# EAGLE design Design_final (EAGLE 9.2.2)
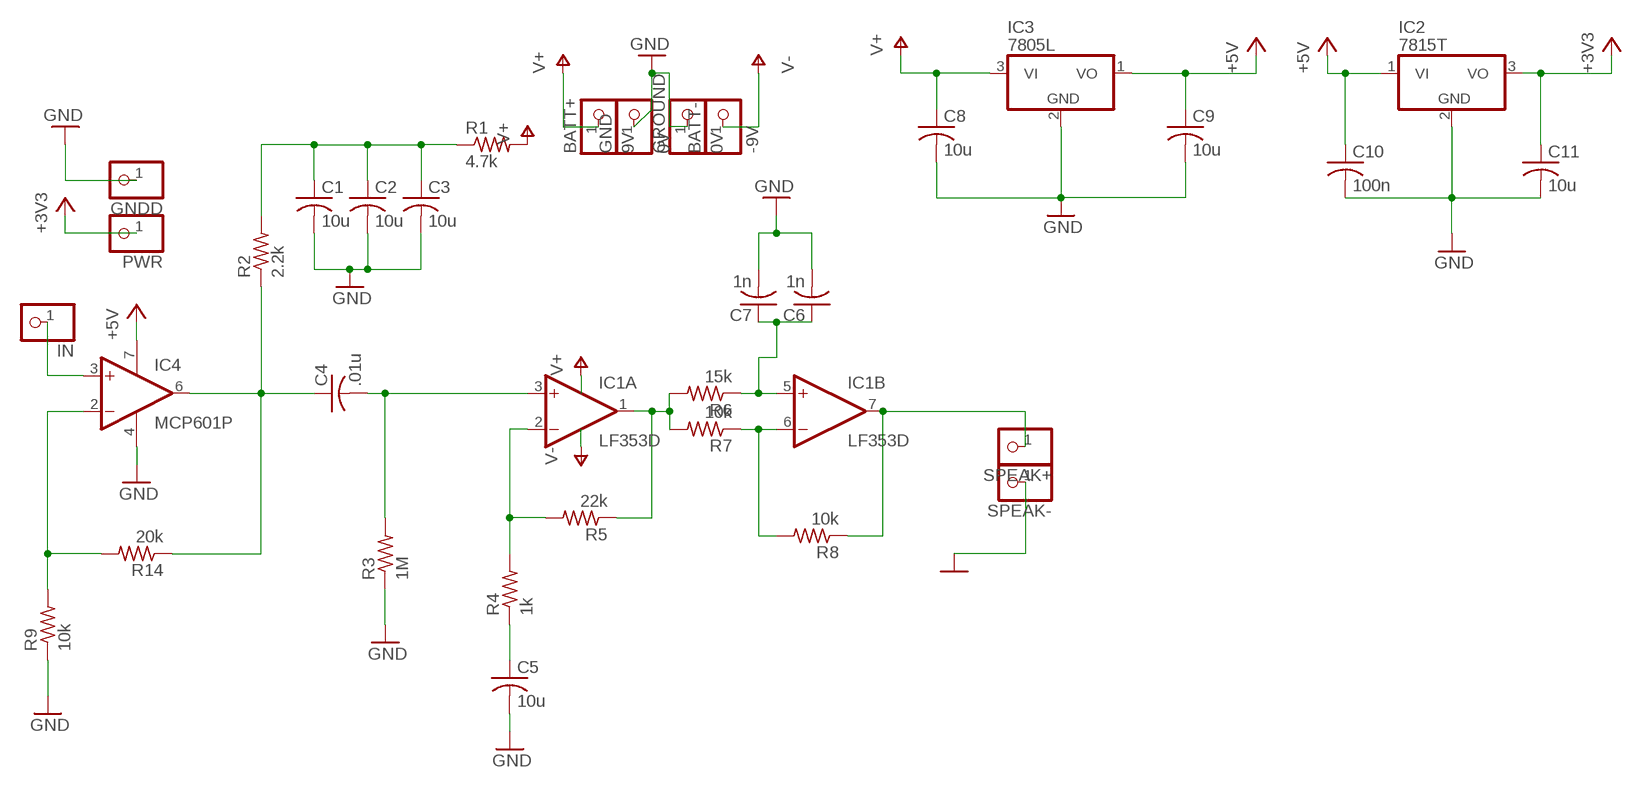
[diagram p0: schematic, sheet 1]

## Parts
BATT+  9V  PINHD-1X1  [1X01]
BATT-  -9V  PINHD-1X1  [1X01]
C1  10u  C-USC0805  [C0805]
C2  10u  C-USC0805  [C0805]
C3  10u  C-USC0805  [C0805]
C4  .01u  C-USC0805  [C0805]
C5  10u  C-USC0805  [C0805]
C6  1n  C-USC0805  [C0805]
C7  1n  C-USC0805  [C0805]
C8  10u  C-USC0805  [C0805]
C9  10u  C-USC0805  [C0805]
C10  100n  C-USC0805  [C0805]
C11  10u  C-USC0805  [C0805]
GND  0V  PINHD-1X1  [1X01]
GNDD  PINHD-1X1  [1X01]
GROUND  0V  PINHD-1X1  [1X01]
IC1  LF353D  [SO08]
IC2  7815T  [TO220H]
IC3  7805L  [TO92]
IC4  MCP601P  [DIL08]
IN  PINHD-1X1  [1X01]
PWR  PINHD-1X1  [1X01]
R1  4.7k  R-US_M0805  [M0805]
R2  2.2k  R-US_M0805  [M0805]
R3  1M  R-US_M0805  [M0805]
R4  1k  R-US_M0805  [M0805]
R5  22k  R-US_M0805  [M0805]
R6  15k  R-US_M0805  [M0805]
R7  10k  R-US_M0805  [M0805]
R8  10k  R-US_M0805  [M0805]
R9  10k  R-US_M0805  [M0805]
R14  20k  R-US_M0805  [M0805]
SPEAK+  PINHD-1X1  [1X01]
SPEAK-  PINHD-1X1  [1X01]

## Nets
+3V3: C11.1 IC2.3(VO) PWR.1
+5V: C9.1 C10.1 IC2.1(VI) IC3.1(VO) IC4.7(V+)
GND: C1.2 C2.2 C3.2 C5.2 C6.2 C7.2 C8.2 C9.2 C10.2 C11.2 GND.1 GNDD.1 GROUND.1 IC2.2(GND) IC3.2(GND) IC4.4(V-) R3.1 R9.1 SPEAK-.1
N$1: C1.1 C2.1 C3.1 R1.1 R2.2
N$2: IC1.6(B:-IN) R7.1 R8.2
N$3: IC4.3(+IN) IN.1
N$4: C4.1 IC4.6(OUT) R2.1 R14.1
N$6: C4.2 IC1.3(A:+IN) R3.2
N$7: IC1.2(A:-IN) R4.2 R5.2
N$8: C5.1 R4.1
N$9: IC1.1(A:OUT) R5.1 R6.2 R7.2
N$12: IC1.7(B:OUT) R8.1 SPEAK+.1
N$13: C6.1 C7.1 IC1.5(B:+IN) R6.1
N$15: IC4.2(-IN) R9.2 R14.2
V+: BATT+.1 C8.1 IC3.3(VI) R1.2
V-: BATT-.1

## Power pins joined to a net without a drawn wire
V+: IC1.8(P:V+)
V-: IC1.4(P:V-)

## Library data of the parts
BATT+ BATT- GND GNDD GROUND IN PWR SPEAK+ SPEAK- = adafruit:PINHD-1X1: Pin header 1x1 for 0.1" spacing With round pins
C1-C11 = adafruit:C-US: CAPACITOR, American symbol
IC1 = linear:LF353: OP AMP
IC2 IC3 = adafruit:78*: Positive VOLTAGE REGULATOR Added bigger pads to the TO-92 package
IC4 = linear:MCP601: Single Op Amp 2.7V to 6.0V Single Supply CMOS Source: http://ww1.microchip.com/downloads/en/DeviceDoc/21314g.pdf
R1-R9 R14 = adafruit:R-US_: RESISTOR, American symbol

## Net classes
0 default: width 0.508 mm, clearance 0.508 mm

## Board
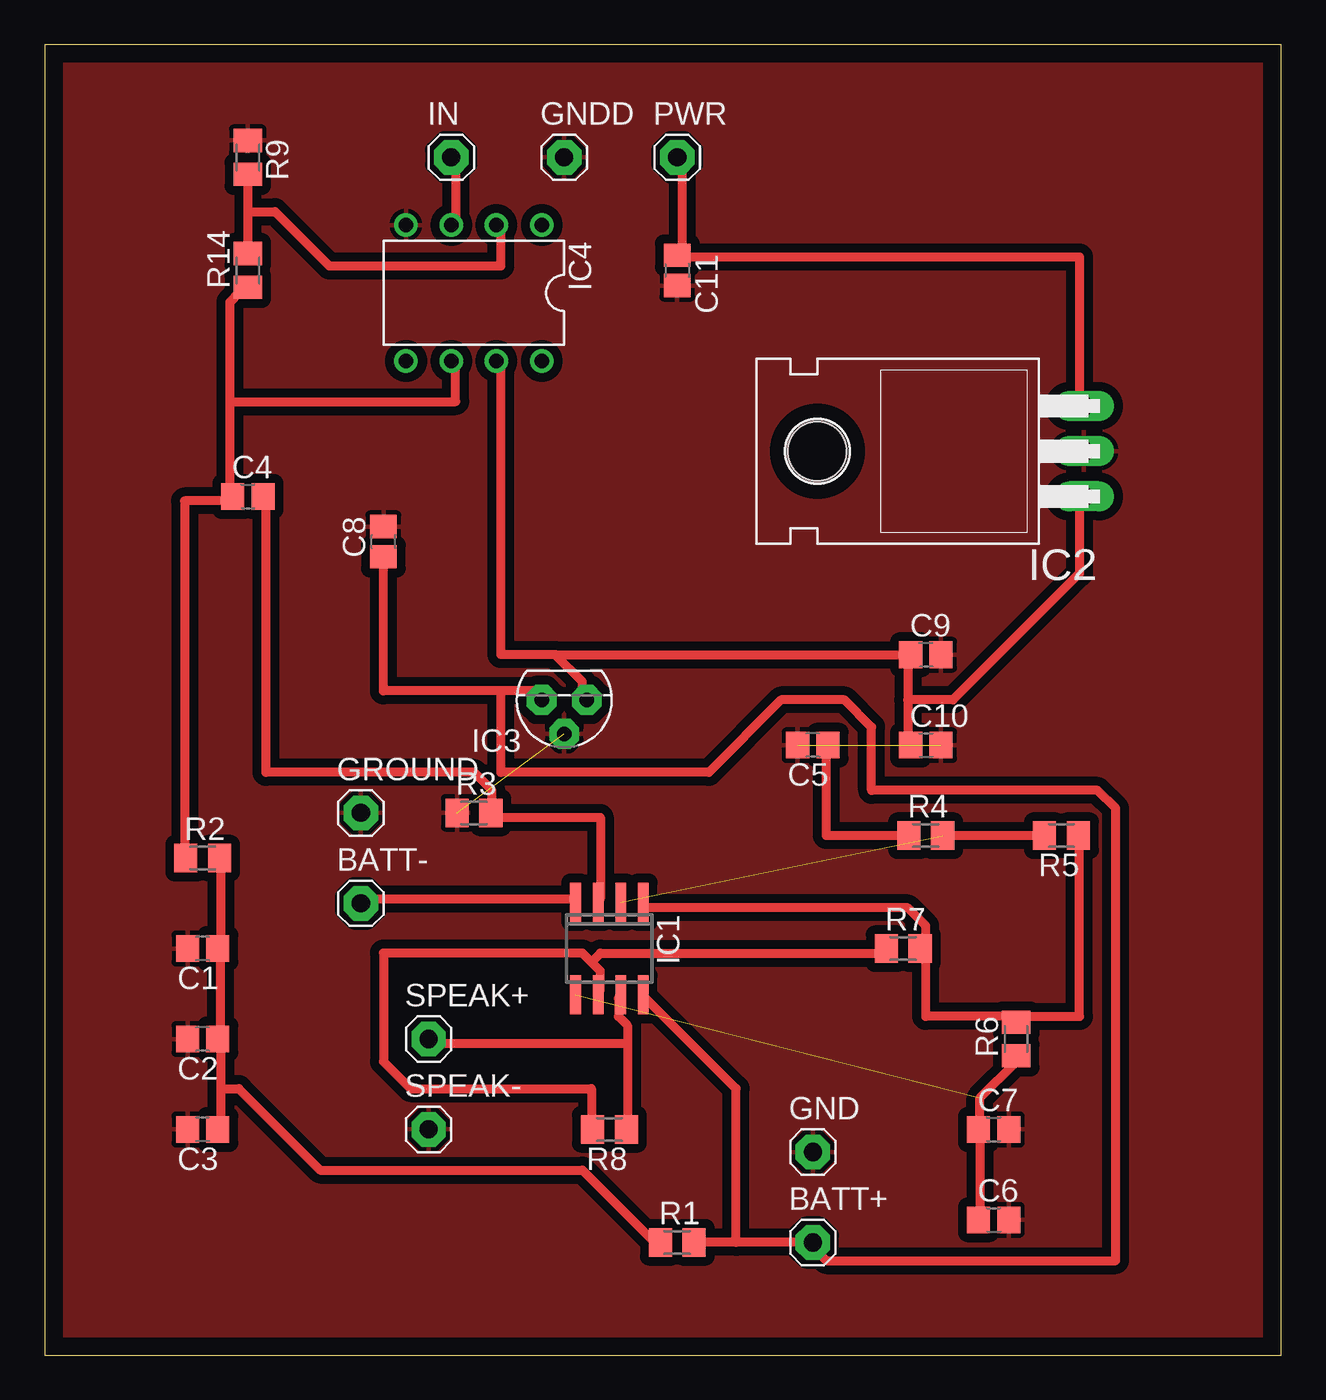
[diagram p1: board, top side]

Size 69.52 x 73.65 mm. Coordinates in mm from the lower left corner, seen from the top.
Outline: 0,0 69.52,0 69.52,73.65 0,73.65 0,0
Copper layers (1*16): Top 0.035mm / dielectric 1.5mm / Bottom 0.035mm
Design rules "default *": minimum track width 20mil, minimum drill 0.35mm, track to track 20mil, track to pad 20mil, pad to pad 20mil, via to via 20mil, smd to smd 20mil, copper to edge 40mil, drill to drill 6mil, minimum pad ring 10mil, minimum via ring 8mil, stop-mask expansion 4mil, vias tented up to drill 0mil, thermal gap 10mil

### Footprints (pad centres in the part's own frame; a part is rotated, then mirrored left to right if it is on the bottom)
1X01 = drill 1.016 pad 1.93 octagon: 1 0,0
C0805 = smd 1.3 x 1.5: 1 -0.85,0; 2 0.85,0
SO08 = smd 0.6 x 2.2: 1 -1.905,-2.6; 2 -0.635,-2.6; 3 0.635,-2.6; 4 1.905,-2.6; 5 1.905,2.6; 6 0.635,2.6; 7 -0.635,2.6; 8 -1.905,2.6
TO220H = drill 1.118 long: 1 -2.54,-10.16; 2 0,-10.16; 3 2.54,-10.16 | hole 3.302: 0,4.826
TO92 = drill 0.813 pad 1.676 octagon: 1 -1.27,0; 2 0,1.905; 3 1.27,0
DIL08 = drill 0.813 pad 1.27: 1 -3.81,-3.81; 2 -1.27,-3.81; 3 1.27,-3.81; 4 3.81,-3.81; 5 3.81,3.81; 6 1.27,3.81; 7 -1.27,3.81; 8 -3.81,3.81
M0805 = smd 1.3 x 1.6: 1 -0.95,0; 2 0.95,0

### Placement (x,y rotation side)
BATT+  43.18,6.35 0 top
BATT-  17.78,25.4 0 top
C1  8.89,22.86 180 top
C2  8.89,17.78 180 top
C3  8.89,12.7 180 top
C4  11.43,48.26 0 top
C5  43.18,34.29 180 top
C6  53.34,7.62 0 top
C7  53.34,12.7 0 top
C8  19.05,45.72 90 top
C9  49.53,39.37 0 top
C10  49.53,34.29 0 top
C11  35.56,60.96 270 top
GND  43.18,11.43 0 top
GNDD  29.21,67.31 0 top
GROUND  17.78,30.48 0 top
IC1  31.75,22.86 180 top
IC2  48.26,50.8 90 top
IC3  29.21,36.83 180 top
IC4  24.13,59.69 180 top
IN  22.86,67.31 0 top
PWR  35.56,67.31 0 top
R1  35.56,6.35 0 top
R2  8.89,27.94 0 top
R3  24.13,30.48 0 top
R4  49.53,29.21 0 top
R5  57.15,29.21 180 top
R6  54.61,17.78 90 top
R7  48.26,22.86 0 top
R8  31.75,12.7 180 top
R9  11.43,67.31 270 top
R14  11.43,60.96 90 top
SPEAK+  21.59,17.78 0 top
SPEAK-  21.59,12.7 0 top

### Tracks (layer width: path | path; a pad name or v marks a point on that pad's centre or on a via)
+3V3
  Top 0.508: PWR.1 35.81,67.31 35.81,62.23 C11.1 35.81,61.72 58.17,61.72 58.17,53.59 IC2.3
+5V
  Top 0.508: 48.51,39.37 48.51,36.83 | 48.51,36.83 48.51,34.29 C10.1 | 48.51,36.83 51.05,36.83 58.17,43.94 58.17,48.01 IC2.1 | 28.7,39.37 25.65,39.37 25.65,55.63 IC4.7 | 28.7,39.37 30.23,37.85 30.23,36.83 IC3.1 | 28.7,39.37 48.51,39.37 | 48.51,39.37 C9.1
GND  (2 unrouted)
  pour Top (isolate 0.508): -33.02,78.74 -33.02,-8.89 93.98,-8.89 93.98,78.74
N$1
  Top 0.508: R2.2 9.91,27.69 9.91,23.11 C1.1 9.91,22.61 9.91,18.03 C2.1 9.91,17.53 9.91,14.99 | 9.91,14.99 9.91,12.95 C3.1 | 9.91,14.99 10.92,14.99 15.49,10.41 30.23,10.41 34.29,6.35 R1.1
N$2
  Top 0.508: 30.73,22.1 31.24,21.59 31.24,20.57 IC1.6 | 30.73,22.1 30.23,22.61 19.05,22.61 19.05,16.51 20.57,14.99 30.73,14.99 30.73,12.95 R8.2 | 30.73,22.1 31.24,22.61 46.99,22.61 R7.1
N$3
  Top 0.508: IC4.3 23.11,63.75 23.11,67.31 IN.1
N$4
  Top 0.508: 10.41,53.59 10.41,59.18 10.92,59.69 11.43,59.69 R14.1 | 10.41,53.59 10.41,48.51 C4.1 10.41,48.01 7.87,48.01 7.87,28.19 R2.1 | 10.41,53.59 23.11,53.59 23.11,55.63 IC4.6
N$6
  Top 0.508: C4.2 12.45,48.01 12.45,32.77 24.13,32.77 25.15,31.75 25.15,30.73 R3.2 25.15,30.23 31.24,30.23 31.24,25.65 IC1.3
N$7  (1 unrouted)
  Top 0.508: R5.2 R4.2
N$8
  Top 0.508: R4.1 43.94,29.21 43.94,34.29 C5.1
N$9
  Top 0.508: 54.61,19.05 49.53,19.05 49.53,22.61 R7.2 49.53,23.11 49.53,24.13 48.51,25.15 33.78,25.15 IC1.1 | 54.61,19.05 58.17,19.05 58.17,29.21 R5.1 | 54.61,19.05 R6.2
N$12
  Top 0.508: 32.77,17.53 32.77,18.54 32.26,19.05 32.26,20.07 IC1.7 | 32.77,17.53 32.77,12.95 R8.1 | 32.77,17.53 21.59,17.53 SPEAK+.1
N$13  (1 unrouted)
  Top 0.508: C6.1 52.58,7.87 52.58,12.45 C7.1 52.58,12.95 52.58,14.48 54.61,16.51 R6.1
N$15
  Top 0.508: R9.2 11.43,64.26 | 11.43,64.26 R14.2 | 11.43,64.26 12.95,64.26 16,61.21 25.65,61.21 25.65,63.25 IC4.2
V+
  Top 0.508: C8.1 19.05,37.34 25.65,37.34 | 25.65,37.34 27.69,37.34 28.19,36.83 IC3.3 | 42.93,6.35 38.86,6.35 | 38.86,6.35 R1.2 | 38.86,6.35 38.86,14.99 33.78,20.07 IC1.8 | 25.65,37.34 25.65,32.77 37.34,32.77 41.4,36.83 44.96,36.83 46.48,35.31 46.48,31.75 59.18,31.75 60.2,30.73 60.2,5.33 43.94,5.33 42.93,6.35 | 42.93,6.35 BATT+.1
V-
  Top 0.508: IC1.4 29.72,25.65 18.03,25.65 BATT-.1